# EAGLE design 1ssrCompactBoard (EAGLE 7.6.0)
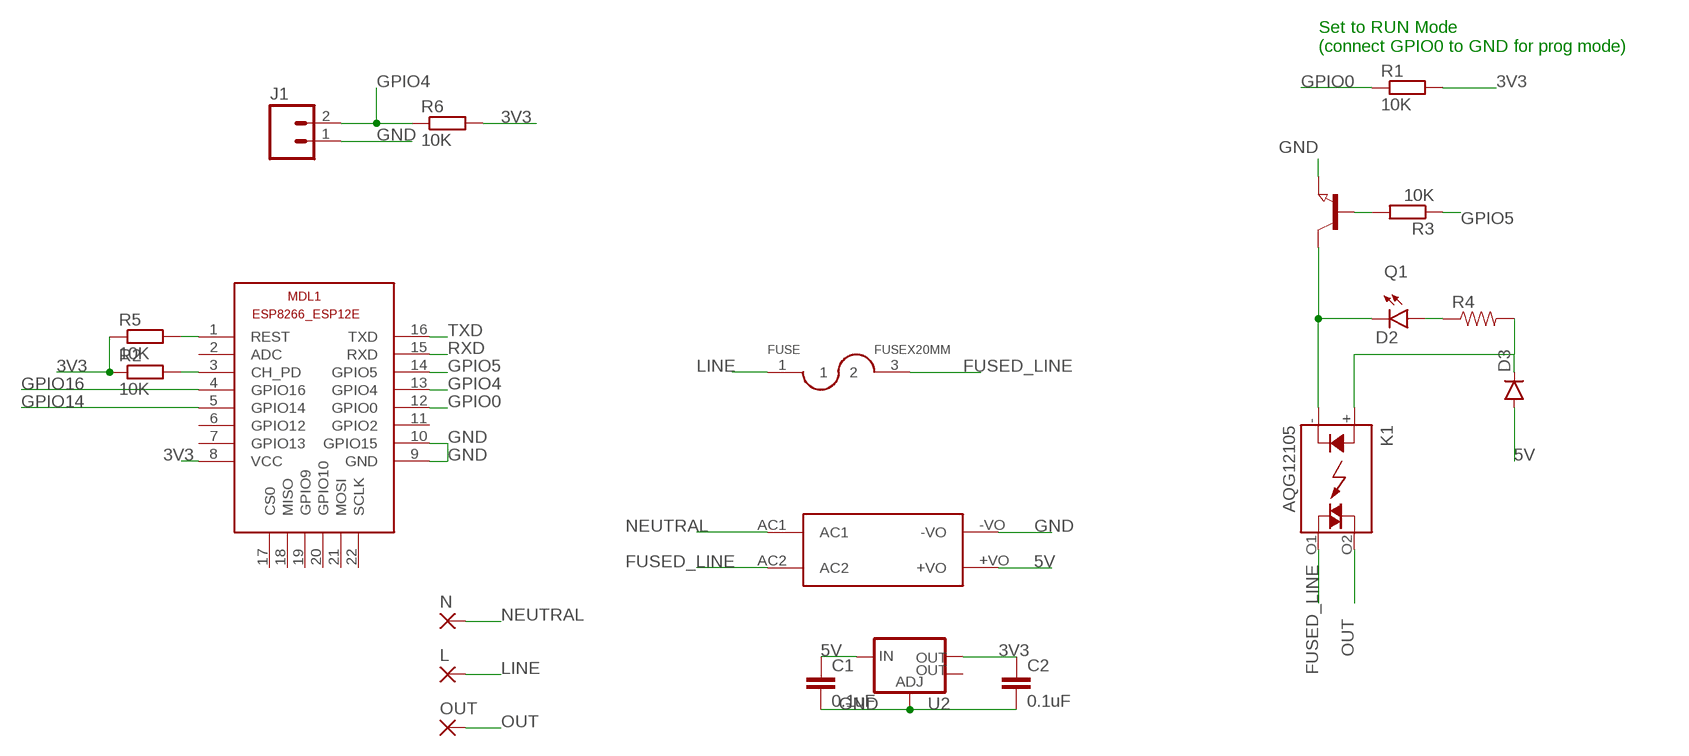
[diagram p0: schematic, sheet 1]

## Parts
C1  0.1uF  0.1UF-25V-5%(0603)  [0603-CAP]
C2  0.1uF  0.1UF-25V-5%(0603)  [0603-CAP]
D2  LED0603  [LED-0603]
D3  DIODESMA  [SMA-DIODE]
FUSE  FUSEX20MM  [FUSE_5MM]
J1  M02PTH3  [1X02_LONGPADS]
K1  AQG12105  [AQG]
L  3,81/1,1  [3,81/1,1]
MDL1  ESP8266-12EESP8266-ESP12E  [ESP8266-ESP12E]
N  3,81/1,1  [3,81/1,1]
OUT  3,81/1,1  [3,81/1,1]
Q1  NPN-TRANSISTOR_SOT23  [SOT23]
R1  10K  R-EU_R0805  [R0805]
R2  10K  R-EU_R0805  [R0805]
R3  10K  R-EU_R0805  [R0805]
R4  RESISTOR0603  [0603-RES]
R5  10K  R-EU_R0805  [R0805]
R6  10K  R-EU_R0805  [R0805]
U2  V_REG_LM1117SOT223  [SOT223]
U$4  HLK-PM01  [HLK-PM01]

## Nets
3V3: C2.1 MDL1.8(VCC) R1.2 R2.1 R5.1 R6.2 U2.2(OUT)
5V: C1.1 D3.A U2.3(IN) U$4.+VO
FUSED_LINE [ac]: FUSE.3 K1.O1(DS2) U$4.AC2
GND: C1.2 C2.2 J1.1 MDL1.9(GND) MDL1.10(GPIO15) Q1.2(E) U2.1(ADJ) U$4.-VO
GPIO0: MDL1.12(GPIO0) R1.1
GPIO4: J1.2 MDL1.13(GPIO4) R6.1
GPIO5: MDL1.14(GPIO5) R3.1
GPIO14: MDL1.5(GPIO14)
GPIO16: MDL1.4(GPIO16)
LINE [ac]: FUSE.1 L.1(P)
N$1: D2.A R4.1
N$3: D3.C K1.+(A) R4.2
N$6: MDL1.1(REST) R5.2
N$9: MDL1.3(CH_PD) R2.2
N$10: D2.C K1.-(K) Q1.3(C)
N$12: Q1.1(B) R3.2
NEUTRAL [ac]: N.1(P) U$4.AC1
OUT [ac]: K1.O2(DS1) OUT.1(P)
RXD: MDL1.15(RXD)
TXD: MDL1.16(TXD)
Unconnected: MDL1.2(ADC) MDL1.6(GPIO12) MDL1.7(GPIO13) MDL1.11(GPIO2) MDL1.17(CS0) MDL1.18(MISO) MDL1.19(GPIO9) MDL1.20(GPIO10) MDL1.21(MOSI) MDL1.22(SCLK) U2.4(OUT)

## Notes on the sheet
- Set to RUN Mode
  (connect GPIO0 to GND for prog mode)

## Library data of the parts
C1 C2 = SparkFun-Capacitors:0.1UF-25V-5%(0603): CAP-08604; PROD_ID: CAP-08604
D2 = SparkFun-LED:LED: LEDs Standard schematic elements and footprints for 5mm, 3mm, 1206, and 0603 sized LEDs. 5mm - Spark Fun Electronics SKU : COM-00529 (and others)
D3 = SparkFun-DiscreteSemi:DIODE: Diode These are standard reverse protection diodes and small signal diodes. SMA package can handle up to about 1A. SOD-323 can handle about 200mA. What the SOD-323 package when ordering, there are some mfgs out there that are 5-pin packages.
FUSE = SparkFun-Passives:FUSE
J1 = SparkFun-Connectors:M02: Standard 2-pin 0.1" header. Use with - straight break away headers ( PRT-00116) - right angle break away headers (PRT-00553) - swiss pins (PRT-00743) - machine pins (PRT-00117) - female headers (PRT-00115) Molex polarized connector foot print use with: PRT-08233 with associated crimp pins and housings. 2.54_SCREWTERM for use with PRT-10571. 3.5mm Screw Terminal footprints for PRT-08084 5mm Screw Terminal footprints for use with PRT-08432
K1 = relay:AQG*: SOLID STATE RELAY NAiS Zero-cross, Non zero-cross Source: http://www.mew-europe.com/.. en_ds_61611_0000.pdf; MF: AROMAT/ MATSUSHITA; MPN: AQG12105; OC_FARNELL: unknown; OC_NEWARK: 20J4759
L N OUT = wirepad:3,81/1,1: THROUGH-HOLE PAD
MDL1 = ESP8266-ESP12E:ESP8266-12E: ESP8266-12E with additional I/O and GPIO04/05 corrected The author cannot warrant that this library is free from error or will meet your specific requirements. Created by PuceBaboon.com. Komagane, Nagano, JAPAN
Q1 = semicon-smd-ipc:NPN-TRANSISTOR_: NPN TRANSISTOR
R1-R3 R5 R6 = resistor:R-EU_: RESISTOR, European symbol
R4 = SparkFun-Resistors:RESISTOR: Resistor Basic schematic elements and footprints for 0603, 1206, and PTH resistors.
U2 = SparkFun-PowerIC:V_REG_LM1117: Voltage Regulator LM1117 Standard adjustable voltage regulator but in SMD form. Spark Fun Electronics SKU : COM-00595; PROD_ID: VREG-08170
U$4 = hlk-pm01:HLK-PM01

## Net classes
0 default: width 0.152 mm, drill 0.305 mm, clearance 0.152 mm
1 ac: width 1.27 mm, drill 1.27 mm, clearance 2.54 mm

## Board
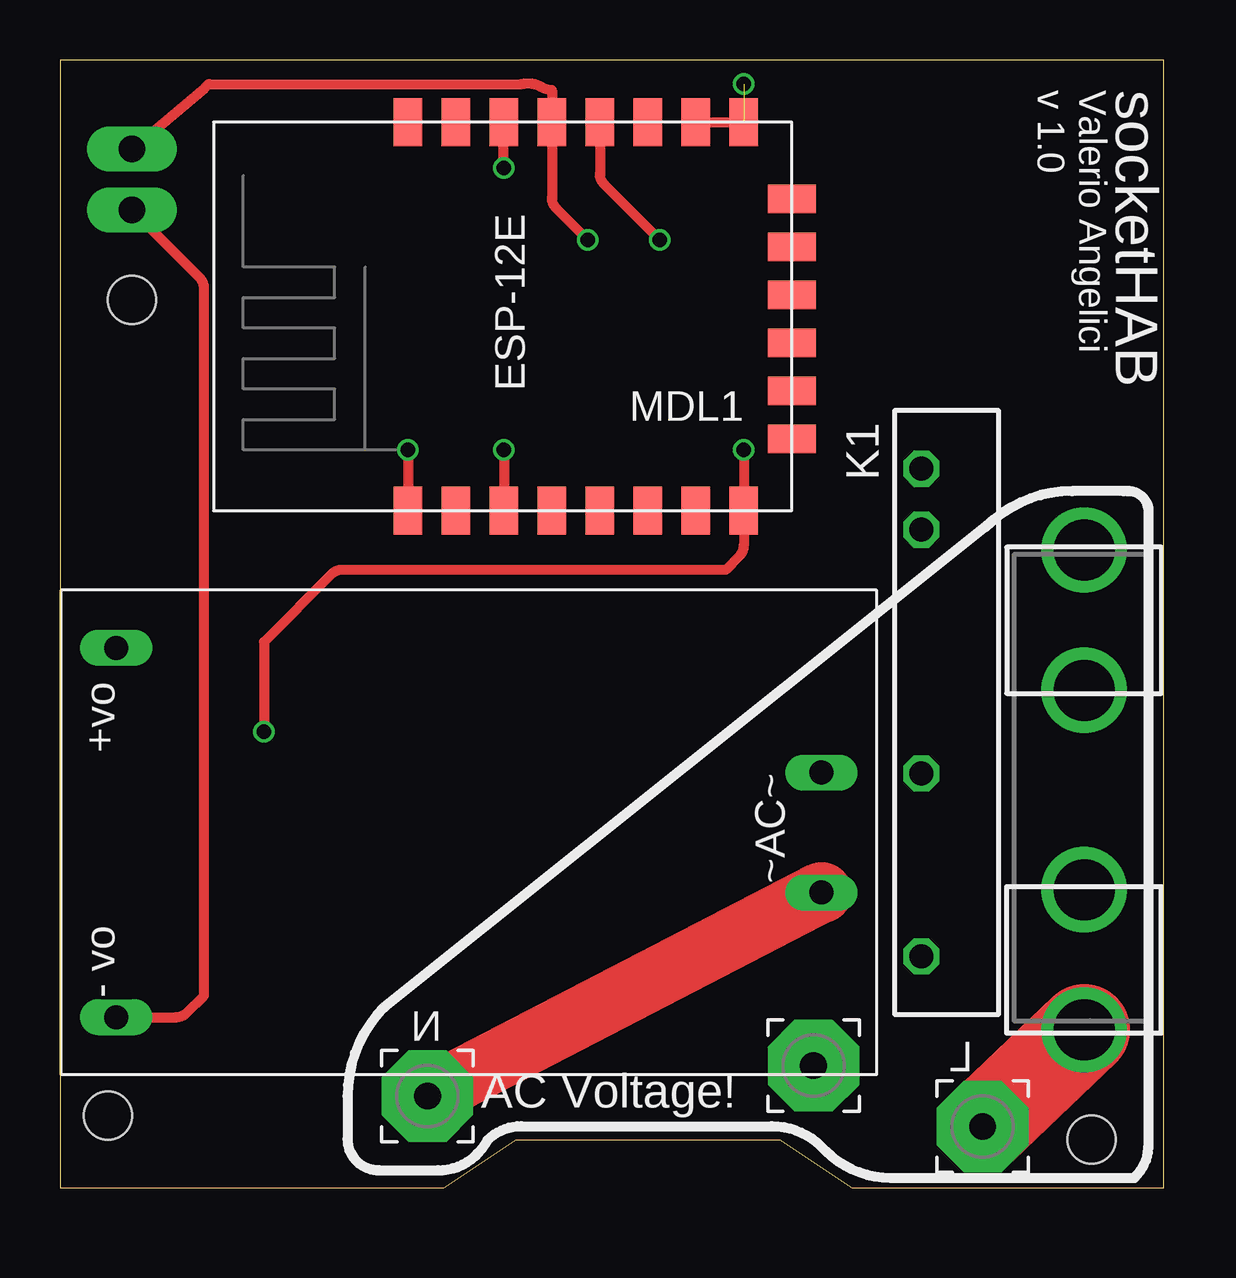
[diagram p1: board, top side]
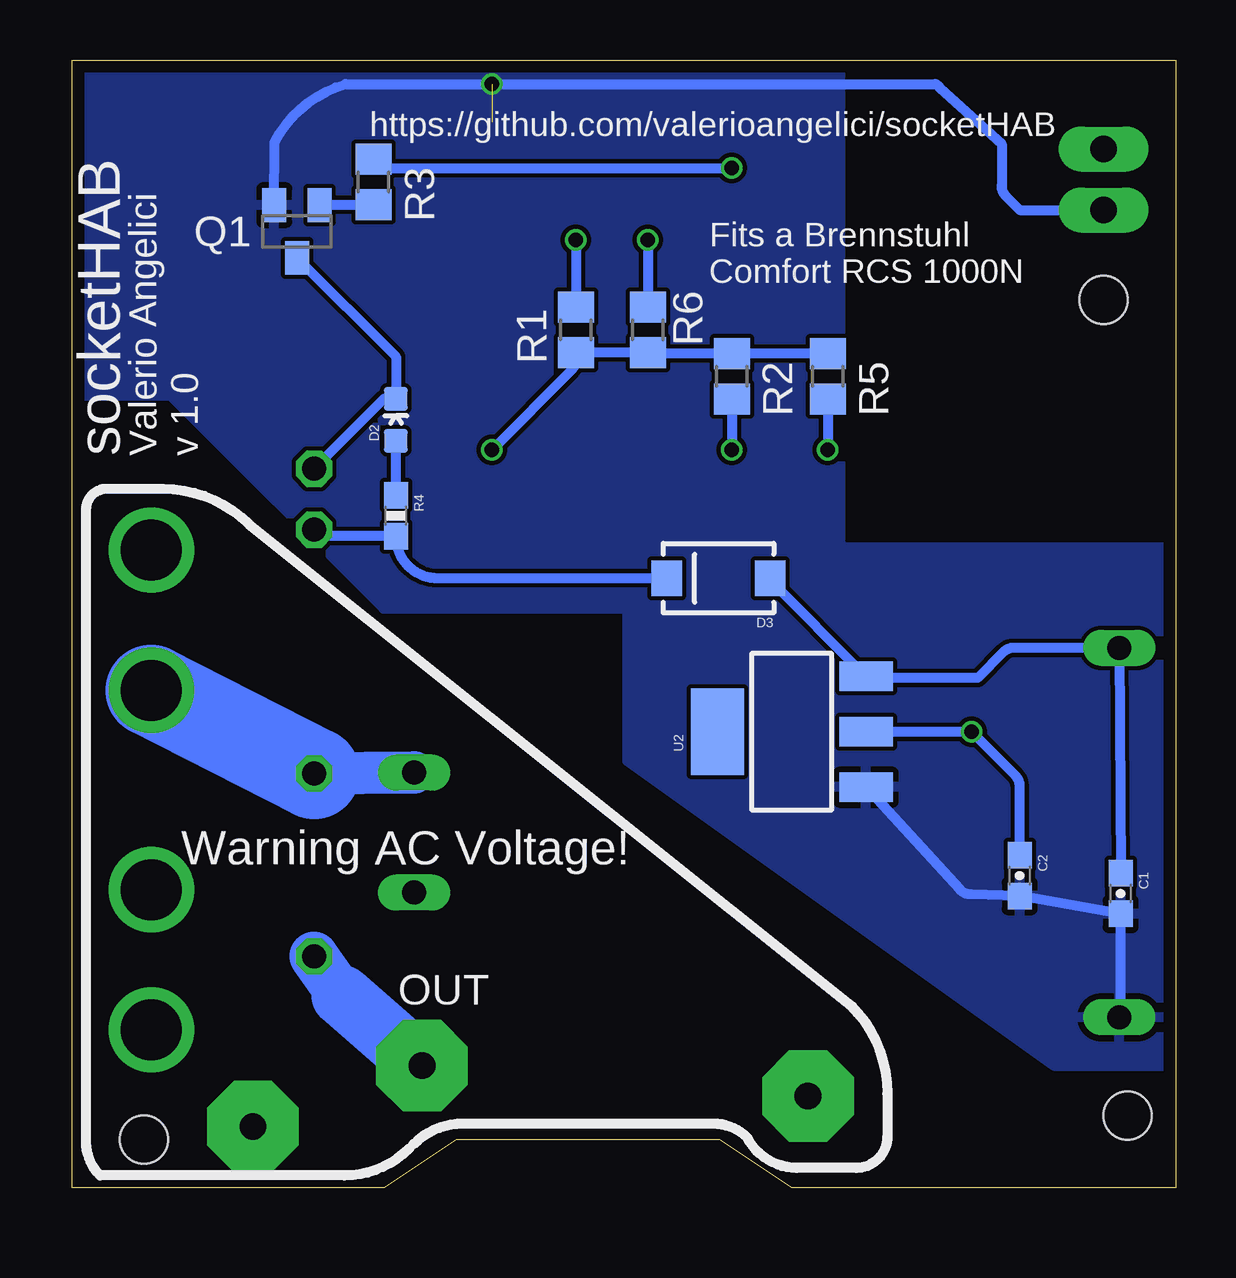
[diagram p2: board, bottom side, seen from below]

Size 46 x 47 mm. Coordinates in mm from the lower left corner, seen from the top.
Outline: 0,0 16,0 19,2 30,2 33,0 46,0 46,47 0,47 0,0
Copper layers (1*16): Top 0.035mm / dielectric 1.5mm / Bottom 0.035mm
Design rules "ShenZhen2U EagleRules": minimum track width 7mil, minimum drill 12mil, track to track 7mil, track to pad 7mil, pad to pad 7mil, via to via 7mil, smd to smd 0mil, copper to edge 20mil, drill to drill 10mil, minimum pad ring 10mil, minimum via ring 6mil, stop-mask expansion 2mil, vias tented up to drill 25mil, thermal gap 10mil
Holes 2 mm at 3,37 43,2 2,3

### Footprints (pad centres in the part's own frame; a part is rotated, then mirrored left to right if it is on the bottom)
0603-CAP = smd 1.1 x 1: 1 -0.85,0; 2 0.85,0
LED-0603 = smd 1 x 1: A 0,-0.877; C 0,0.877
SMA-DIODE = smd 1.27 x 1.47: A -2.15,0; C 2.15,0
FUSE_5MM = drill 2.54 pad 3.556: 1 0,-10; 2 0,-4.158; 3 0,4.158; 4 0,10
1X02_LONGPADS = drill 1.118 pad 1.88 long: 1 0,0; 2 2.54,0
AQG = drill 1 octagon: + -7.62,0; - -10.16,0; O1 2.54,0; O2 10.16,0
3,81/1,1 = drill 1.118 pad 3.81 octagon: 1 0,0
ESP8266-ESP12E = smd 2 x 1.2: 1 0,16; 2 0,14; 3 0,12; 4 0,10; 5 0,8; 6 0,6; 7 0,4; 8 0,2; 9 16.2,2; 10 16.2,4; 11 16.2,6; 12 16.2,8; 13 16.2,10; 14 16.2,12; 15 16.2,14; 16 16.2,16 | smd 1.2 x 2: 17 11,0; 18 3,0; 19 5,0; 20 13,0; 21 7,0; 22 9,0
SOT23 = smd 1 x 1.4: 1 -0.95,-1.1; 2 0.95,-1.1; 3 0,1.1
R0805 = smd 1.3 x 1.5: 1 -0.95,0; 2 0.95,0
0603-RES = smd 1.1 x 1: 1 -0.85,0; 2 0.85,0
SOT223 = smd 1.219 x 2.235: 1 -2.311,-3.099; 2 0,-3.099; 3 2.311,-3.099 | smd 3.6 x 2.2: 4 0,3.099
HLK-PM01 = drill 1 long: +VO 31.7,2.4; -VO 31.7,17.8; AC1 2.3,12.6; AC2 2.3,7.6

### Placement (x,y rotation side)
C1  2.29,12.26 270 bottom
C2  6.5,13 270 bottom
D2  32.5,32 0 bottom
D3  19.05,25.4 180 bottom
FUSE  42.69,16.57 0 top
J1  3,40.75 90 top
K1  35.91,19.8 270 top
L  38.46,2.54 0 top
MDL1  30.5,28.21 90 top
N  15.32,3.81 0 top
OUT  31.41,5.08 0 top
Q1  36.62,39.85 180 bottom
R1  25,35.75 270 bottom
R2  18.5,33.81 270 bottom
R3  33.43,41.92 270 bottom
R4  32.5,28 270 bottom
R5  14.5,33.81 270 bottom
R6  22,35.75 270 bottom
U2  16,19 90 bottom
U$4  34.04,24.9 180 top

### Tracks (layer width: path | path; a pad name or v marks a point on that pad's centre or on a via)
3V3  (via drill 0.6)
  Top 0.406: v28.5,30.75 28.5,28.26 arc-45 MDL1.8 28.5,26.76 arc-45 28.31,26.31 27.75,25.75 11.76,25.75 arc45 11.31,25.56 8.5,22.75 v8.5,19
  Bottom 0.406: R5.1 R2.1 21.9,34.76 arc45 R6.2 R1.2 25,34.51 arc45 25.19,34.06 v28.5,30.75 | C2.1 6.5,16.74 arc-45 6.69,17.19 v8.5,19 U2.2
5V
  Bottom 0.406: C1.1 U$4.+VO 6.74,22.5 arc-45 7.19,22.31 8.25,21.25 12.75,21.25 arc45 U2.3 16.99,25.4 D3.A
FUSED_LINE
  Bottom 1.778: K1.O1 U$4.AC2
  Bottom 3.81: K1.O1 FUSE.3
GND  (via drill 0.6)  (1 unrouted)
  Top 0.406: 28.48,46.2 arc-45 v28.5,46 | U$4.-VO 4.84,7.1 arc45 5.29,7.29 6,8 6,37.49 arc45 5.81,37.94 J1.1 | MDL1.10 MDL1.9
  Bottom 0.406: U2.1 8.98,12.41 arc-45 8.53,12.22 C2.2 C1.2 2.29,7.1 U$4.-VO | J1.1 6.5,40.75 7.06,41.31 arc45 7.25,41.76 7.25,43.5 9.81,45.81 arc-45 10.01,46 v28.5,46 34.61,46 arc-45 37.56,43.56 Q1.2
  pour Bottom: 0,5.08 0,26.67 13.72,26.67 arc90 13.97,26.92 13.97,46.99 45.72,46.99 45.72,33.02 41.91,33.02 33.02,24.13 22.86,24.13 22.86,17.78 5.08,5.08
GPIO0  (via drill 0.6)
  Top 0.406: MDL1.12 22.5,42.26 arc45 22.69,41.81 v25,39.5
  Bottom 0.406: v25,39.5 R1.1
GPIO4  (via drill 0.6)
  Top 0.406: J1.2 6.02,45.81 arc-45 6.22,46 19.24,46 arc-45 20.19,45.81 20.5,45.75 20.5,44.46 arc-45 MDL1.13 20.5,41.26 arc45 20.69,40.81 v22,39.5
  Bottom 0.406: v22,39.5 R6.1
GPIO5  (via drill 0.6)
  Top 0.406: v18.5,42.5 arc-45 18.48,42.55 MDL1.14
  Bottom 0.406: R3.1 33.25,42.69 arc-45 32.8,42.5 v18.5,42.5
LINE
  Top 3.81: L.1 FUSE.1
N$1
  Bottom 0.406: R4.1 D2.A
N$3
  Bottom 0.406: K1.+ 35.91,27.15 R4.2 arc-90 30.75,25.4 D3.C
N$6  (via drill 0.6)
  Top 0.406: v14.5,30.75 MDL1.1
  Bottom 0.406: R5.2 v14.5,30.75
N$9  (via drill 0.6)
  Top 0.406: v18.5,30.75 MDL1.3
  Bottom 0.406: R2.2 v18.5,30.75
N$10
  Bottom 0.406: K1.- 32.99,32.88 D2.C 32.5,34.63 Q1.3
N$12
  Bottom 0.406: Q1.1 arc45 35.62,40.97 R3.2
NEUTRAL
  Top 2.54: U$4.AC1 N.1
OUT
  Bottom 2.05: 34.75,8 K1.O2
  Bottom 2.54: OUT.1 34.75,8

### Text on the board
tSilk: Valerio Angelici / v 1.0 | socketHAB | AC Voltage!
_bsilk: https://github.com/valerioangelici/socketHAB | Fits a Brennstuhl / Comfort RCS 1000N | Valerio Angelici / v 1.0 | socketHAB | Warning AC Voltage!